# EAGLE schematic STM32F100C_LightBox (EAGLE 7.2.0)
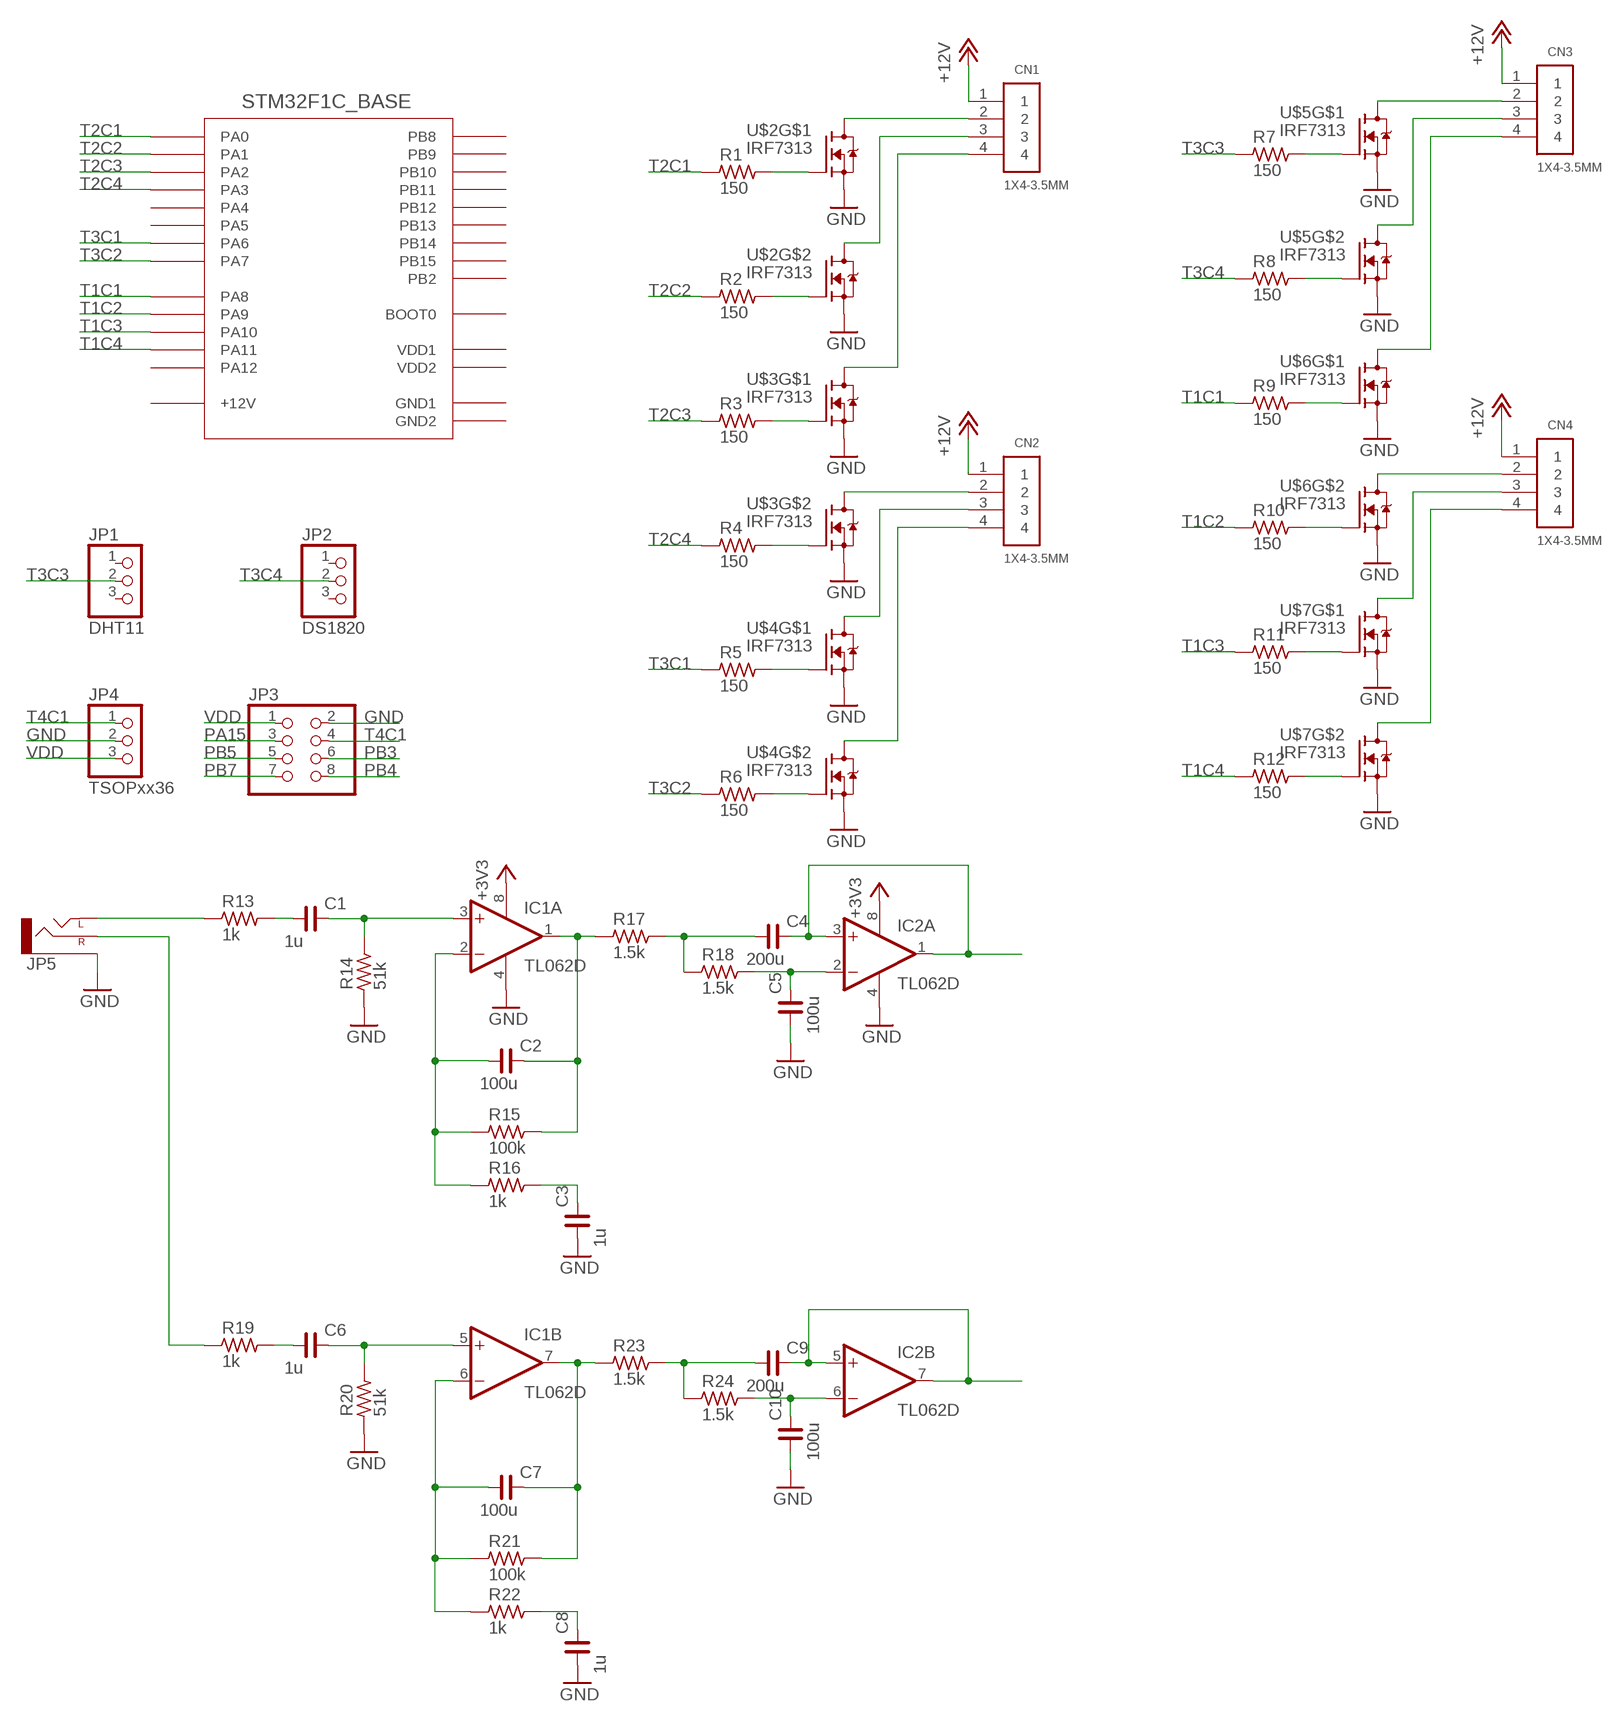
[diagram p0: schematic, sheet 1]

## Parts
C1  1u  C_0603  [C0603]
C2  100u  C_0603  [C0603]
C3  1u  C_0603  [C0603]
C4  200u  C_0603  [C0603]
C5  100u  C_0603  [C0603]
C6  1u  C_0603  [C0603]
C7  100u  C_0603  [C0603]
C8  1u  C_0603  [C0603]
C9  200u  C_0603  [C0603]
C10  100u  C_0603  [C0603]
CN1  1X4-3.5MM  [1X04-3.5MM]
CN2  1X4-3.5MM  [1X04-3.5MM]
CN3  1X4-3.5MM  [1X04-3.5MM]
CN4  1X4-3.5MM  [1X04-3.5MM]
IC1  TL062D  [SO08]
IC2  TL062D  [SO08]
JP1  DHT11  PINHD-1X03_2.54  [1X03]
JP2  DS1820  PINHD-1X03_2.54  [1X03]
JP3  PINHD-2X04_2.54  [2X04]
JP4  TSOPxx36  PINHD-1X03_2.54  [1X03]
JP5  AUDIO-JACK  [AUB-13]
R1  150  R_1206  [R1206]
R2  150  R_1206  [R1206]
R3  150  R_1206  [R1206]
R4  150  R_1206  [R1206]
R5  150  R_1206  [R1206]
R6  150  R_1206  [R1206]
R7  150  R_1206  [R1206]
R8  150  R_1206  [R1206]
R9  150  R_1206  [R1206]
R10  150  R_1206  [R1206]
R11  150  R_1206  [R1206]
R12  150  R_1206  [R1206]
R13  1k  R_1206  [R1206]
R14  51k  R_1206  [R1206]
R15  100k  R_1206  [R1206]
R16  1k  R_1206  [R1206]
R17  1.5k  R_1206  [R1206]
R18  1.5k  R_1206  [R1206]
R19  1k  R_1206  [R1206]
R20  51k  R_1206  [R1206]
R21  100k  R_1206  [R1206]
R22  1k  R_1206  [R1206]
R23  1.5k  R_1206  [R1206]
R24  1.5k  R_1206  [R1206]
U$1  STM32F1C_BASE  [STM32F1_BASE]
U$2  IRF7313  [SO-8]
U$3  IRF7313  [SO-8]
U$4  IRF7313  [SO-8]
U$5  IRF7313  [SO-8]
U$6  IRF7313  [SO-8]
U$7  IRF7313  [SO-8]

## Nets
+3V3: IC1.8(P:V+) IC2.8(P:V+)
+12V: CN1.1 CN2.1 CN3.1 CN4.1
GND: C3.1 C5.1 C8.1 C10.1 IC1.4(P:V-) IC2.4(P:V-) JP3.2 JP4.2 JP5.1(SLEEVE) R14.1 R20.1 U$2.1(S) U$2.3(S) U$3.1(S) U$3.3(S) U$4.1(S) U$4.3(S) U$5.1(S) U$5.3(S) U$6.1(S) U$6.3(S) U$7.1(S) U$7.3(S)
N$1: CN1.2 U$2.7(D) U$2.8(D)
N$2: CN1.3 U$2.5(D) U$2.6(D)
N$3: CN1.4 U$3.7(D) U$3.8(D)
N$4: CN2.2 U$3.5(D) U$3.6(D)
N$5: CN2.3 U$4.7(D) U$4.8(D)
N$6: CN2.4 U$4.5(D) U$4.6(D)
N$7: R1.2 U$2.2(G)
N$8: R2.2 U$2.4(G)
N$9: R3.2 U$3.2(G)
N$10: R4.2 U$3.4(G)
N$11: R5.2 U$4.2(G)
N$12: CN3.2 U$5.7(D) U$5.8(D)
N$13: CN3.3 U$5.5(D) U$5.6(D)
N$14: CN3.4 U$6.7(D) U$6.8(D)
N$15: CN4.2 U$6.5(D) U$6.6(D)
N$16: CN4.3 U$7.7(D) U$7.8(D)
N$17: CN4.4 U$7.5(D) U$7.6(D)
N$18: R7.2 U$5.2(G)
N$19: R8.2 U$5.4(G)
N$20: R9.2 U$6.2(G)
N$21: R10.2 U$6.4(G)
N$22: R11.2 U$7.2(G)
N$23: R6.2 U$4.4(G)
N$24: R12.2 U$7.4(G)
N$25: JP5.3(LEFT) R13.1
N$26: C1.1 R13.2
N$27: C1.2 IC1.3(A:+IN) R14.2
N$28: C2.1 IC1.2(A:-IN) R15.1 R16.1
N$29: C2.2 IC1.1(A:OUT) R15.2 R17.1
N$30: C3.2 R16.2
N$31: JP5.2(RIGHT) R19.1
N$32: C5.2 IC2.2(A:-IN) R18.2
N$33: C4.1 R17.2 R18.1
N$34: C4.2 IC2.1(A:OUT) IC2.3(A:+IN)
N$35: C6.1 R19.2
N$36: C6.2 IC1.5(B:+IN) R20.2
N$37: C7.1 IC1.6(B:-IN) R21.1 R22.1
N$38: C7.2 IC1.7(B:OUT) R21.2 R23.1
N$39: C8.2 R22.2
N$40: C9.1 R23.2 R24.1
N$41: C10.2 IC2.6(B:-IN) R24.2
N$42: C9.2 IC2.5(B:+IN) IC2.7(B:OUT)
PA15: JP3.3
PB3: JP3.6
PB4: JP3.8
PB5: JP3.5
PB7: JP3.7
T1C1: R9.1 U$1.PA8
T1C2: R10.1 U$1.PA9
T1C3: R11.1 U$1.PA10
T1C4: R12.1 U$1.PA11
T2C1: R1.1 U$1.PA0
T2C2: R2.1 U$1.PA1
T2C3: R3.1 U$1.PA2
T2C4: R4.1 U$1.PA3
T3C1: R5.1 U$1.PA6
T3C2: R6.1 U$1.PA7
T3C3: JP1.2 R7.1
T3C4: JP2.2 R8.1
T4C1: JP3.4 JP4.1
VDD: JP3.1 JP4.3
Unconnected: JP1.1 JP1.3 JP2.1 JP2.3 U$1.3.3(VDD1) U$1.3.3_1(VDD2) U$1.B2 U$1.BOOT0 U$1.GND1(GND2) U$1.GND(GND1) U$1.PA4 U$1.PA5 U$1.PA12 U$1.PB8 U$1.PB9 U$1.PB10 U$1.PB11 U$1.PB12 U$1.PB13 U$1.PB14 U$1.PB15

## Power pins joined to a net without a drawn wire
+12V: U$1.+12(+12V)

## Library data of the parts
C1-C10 = rc-master-smd:C_: NON-POLARIZED CAP
CN1-CN4 = adafruit:1X4: 4-pin connector
IC1 IC2 = linear:TL062: OP AMP
JP1 JP2 JP4 = pinhead-2:PINHD-1X03: PIN HEADER
JP3 = pinhead-2:PINHD-2X04: PIN HEADER
JP5 = my-library:AUDIO-JACK: 3.5mm Audio Jack Simple 3.5mm common PCB mount audio jack. SKU: PRT-08032
R1-R24 = rc-master-smd:R_: RESISTOR
U$1 = my-library:STM32F1C_BASE: STM32F100C8 Base Board
U$2-U$7 = my-library:IRF7313